# EAGLE design tracksoar chip shield (EAGLE 7.3.0)
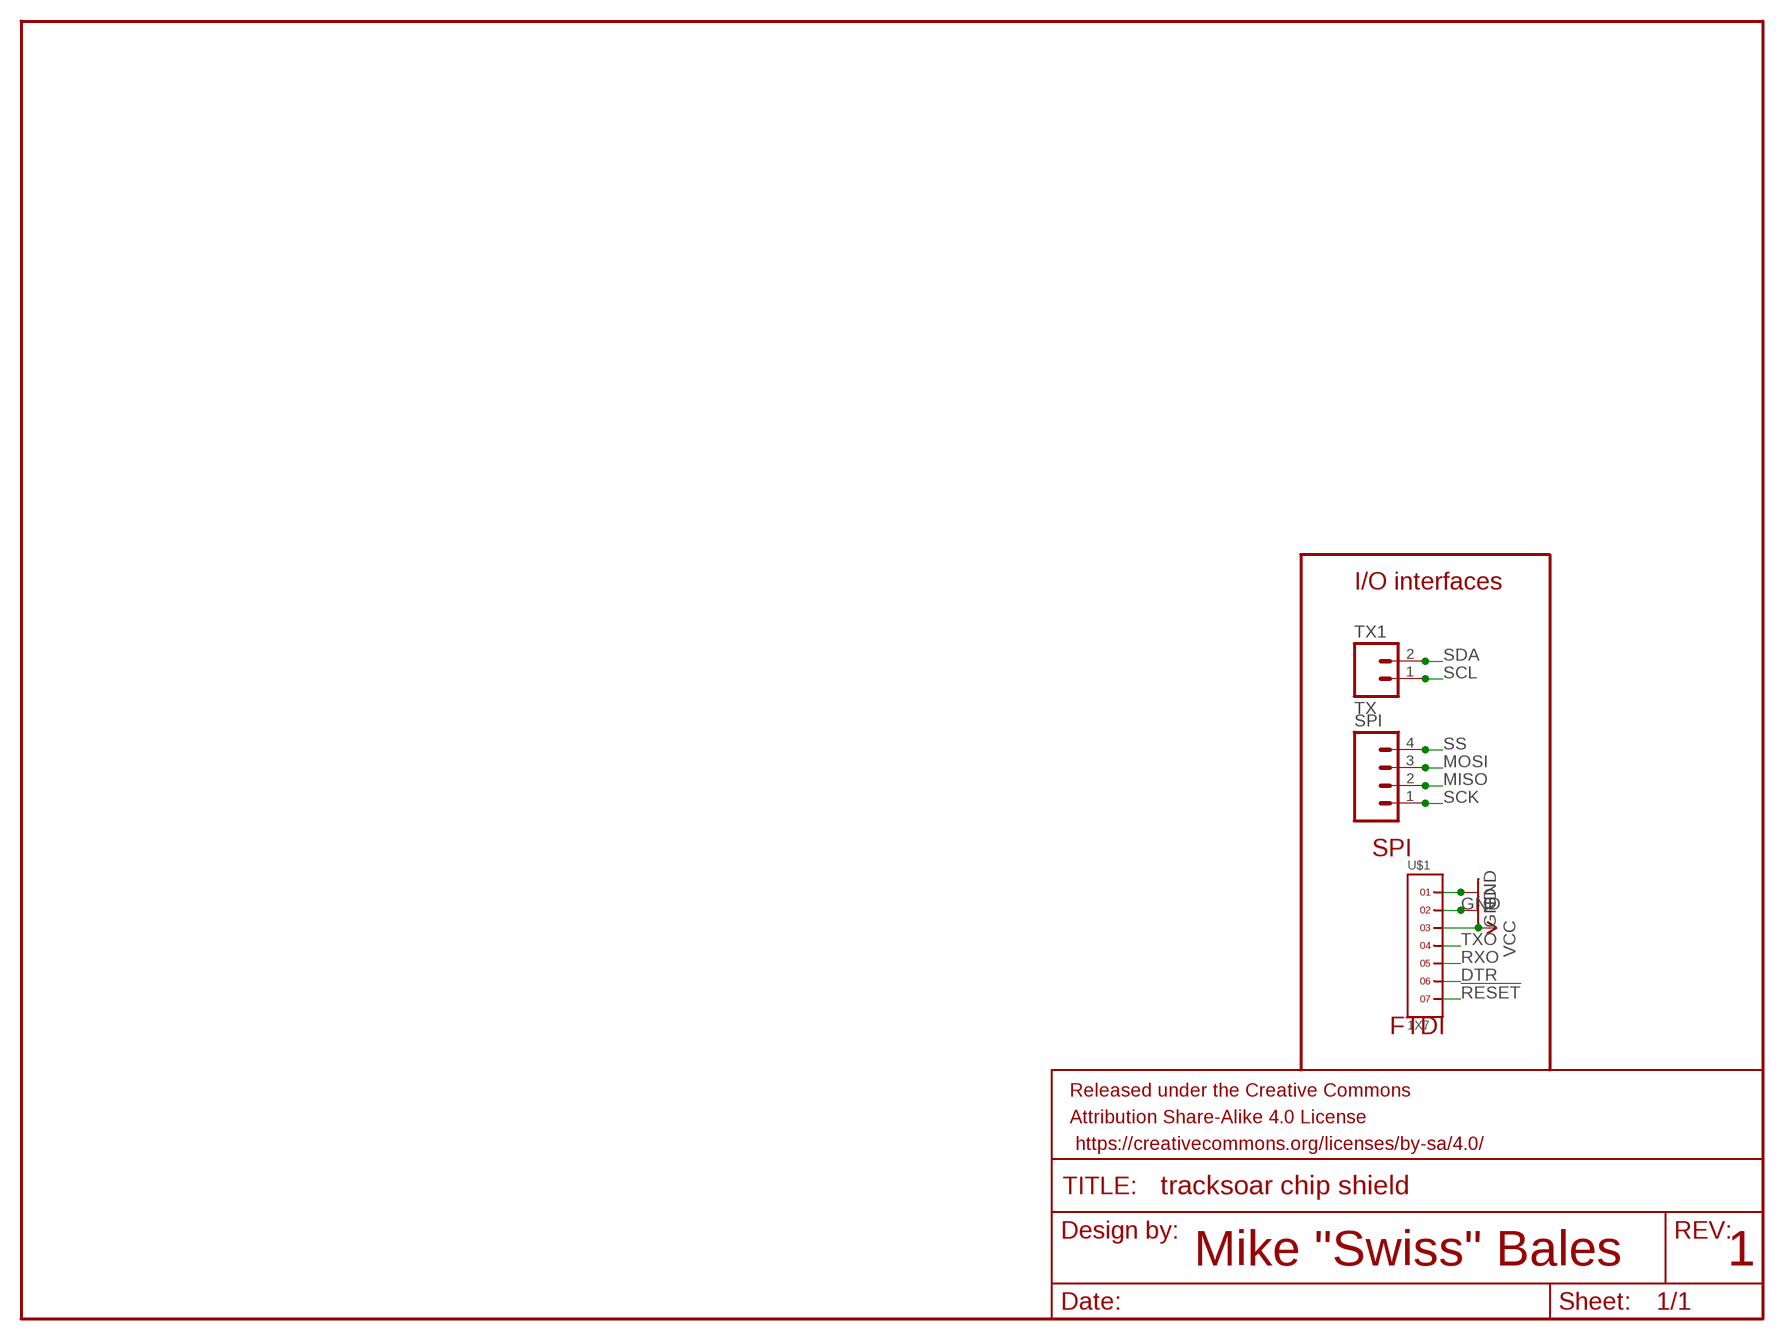
[diagram p0: schematic, sheet 1]

## Parts
FRAME1  FRAME-LETTER  [CREATIVE_COMMONS]
SPI  M04JST-PTH-VERT  [JST-4-PTH-VERT]
TX1  TX  M02JST-PTH-VERT  [JST-2-PTH-VERT]
U$1  1X7  [1X7]

## Nets
!RESET: U$1.7
DTR: U$1.6
GND: U$1.1 U$1.2
MISO: SPI.2
MOSI: SPI.3
RXO: U$1.5
SCK: SPI.1
SCL: TX1.1
SDA: TX1.2
SS: SPI.4
TXO: U$1.4
VCC: U$1.3

## Notes on the sheet
- I/O interfaces
- SPI
- FTDI
- Mike "Swiss" Bales | 1

## Library data of the parts
FRAME1 = SparkFun-Aesthetics:FRAME-LETTER: Schematic Frame Standard 8.5x11 US Letter frame
SPI = SparkFun-Connectors:M04: Header 4 Standard 4-pin 0.1" header. Use with straight break away headers (SKU : PRT-00116), right angle break away headers (PRT-00553), swiss pins (PRT-00743), machine pins (PRT-00117), and female headers (PRT-00115). Molex polarized connector foot print use with SKU : PRT-08231 with associated crimp pins and housings. 1MM SMD Version SKU: PRT-10208
TX1 = SparkFun-Connectors:M02: Standard 2-pin 0.1" header. Use with - straight break away headers ( PRT-00116) - right angle break away headers (PRT-00553) - swiss pins (PRT-00743) - machine pins (PRT-00117) - female headers (PRT-00115) Molex polarized connector foot print use with: PRT-08233 with associated crimp pins and housings. 2.54_SCREWTERM for use with PRT-10571. 3.5mm Screw Terminal footprints for PRT-08084 5mm Screw Terminal footprints for use with PRT-08432
U$1 = headers(2mm):1X7

## Board
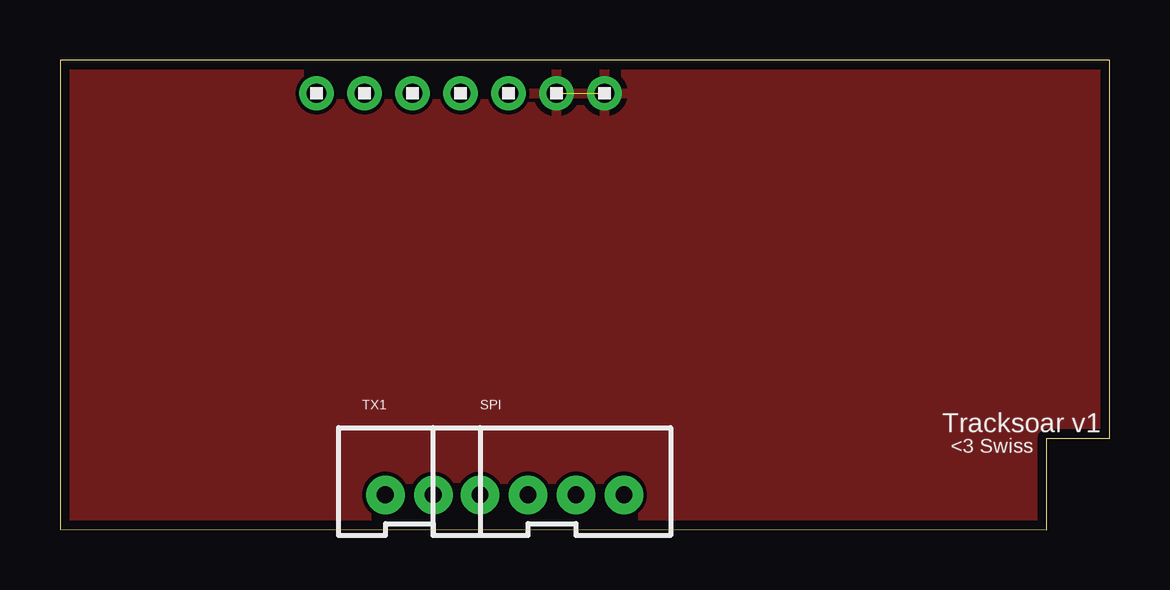
[diagram p1: board, top side]
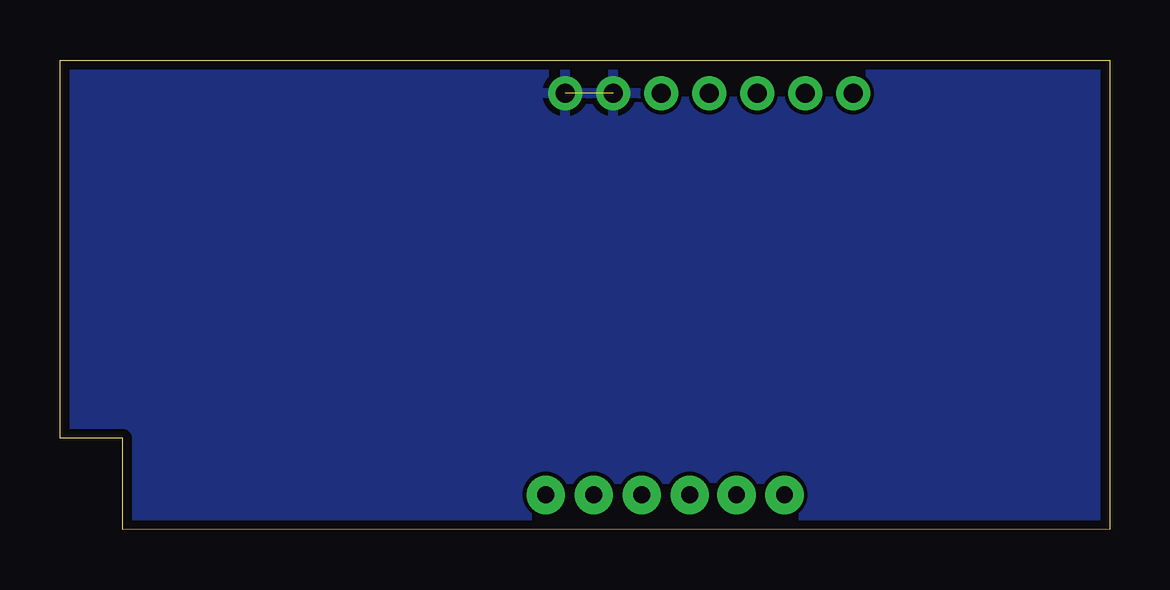
[diagram p2: board, bottom side, seen from below]

Size 43.74 x 19.57 mm. Coordinates in mm from the lower left corner, seen from the top.
Outline: 41.12,0 0,0.03 0,19.57 43.74,19.57 43.74,3.81 41.12,3.81 41.12,0.03
Copper layers (1*16): Top 0.0356mm / dielectric 1.5011mm / Bottom 0.0356mm
Design rules "oshpark-2layer": minimum track width 6mil, minimum drill 13mil, track to track 6mil, track to pad 6mil, pad to pad 6mil, via to via 6mil, smd to smd 6mil, copper to edge 15mil, drill to drill 6mil, minimum pad ring 7mil, minimum via ring 7mil, stop-mask expansion 4mil, vias tented up to drill 0mil, thermal gap 10mil

### Footprints (pad centres in the part's own frame; a part is rotated, then mirrored left to right if it is on the bottom)
JST-4-PTH-VERT = drill 0.7 pad 1.6: 1 -3,-0.55; 2 -1,-0.55; 3 1,-0.55; 4 3,-0.55
JST-2-PTH-VERT = drill 0.7 pad 1.6: 1 -1,-0.55; 2 1,-0.55
1X7 = drill 0.8 pad 1.422: 1 -6,0; 2 -4,0; 3 -2,0; 4 0,0; 5 2,0; 6 4,0; 7 6,0

### Placement (x,y rotation side)
FRAME1  14.78,-7.8 0 top  (outside the outline)
SPI  20.5,2.01 0 top
TX1  14.55,2.01 0 top
U$1  16.69,18.19 180 top

### Tracks (layer width: path | path; a pad name or v marks a point on that pad's centre or on a via)
GND  (1 unrouted)
  pour Top: 0,19.58 43.74,19.58 43.74,0 0,0.03 0.05,3.78
  pour Bottom: 0,19.58 43.74,19.58 43.74,0 0,0.03 0.05,3.78

### Text on the board
tNames: Tracksoar v1 | <3 Swiss